# EAGLE design circuito_domotica_damiano (EAGLE 9.1.3)
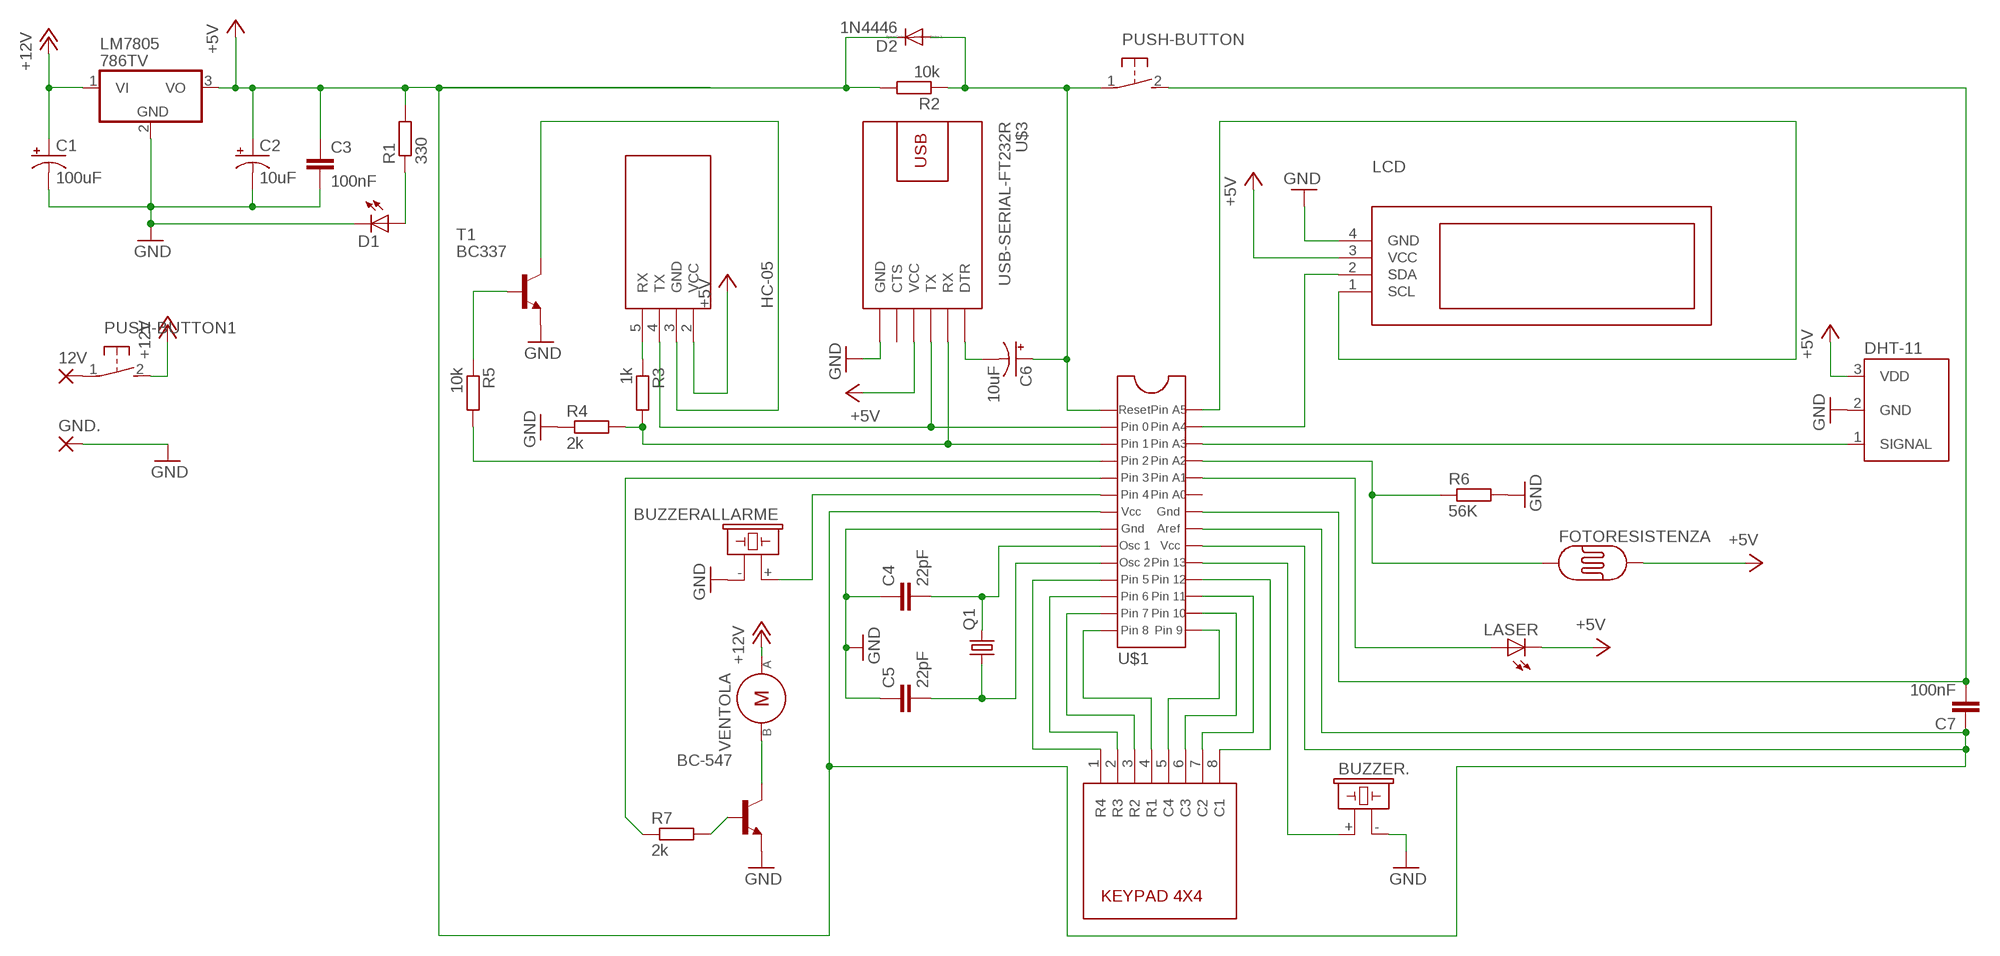
[diagram p0: schematic, sheet 1]

## Parts
12V  WIREPAD1,6/0,8  [1,6/0,8]
BC-547  BC547-NPN-TO92-CBE  [TO92-CBE]
BUZZER.  BPT-24X  [BPT-24X]
BUZZERALLARME  BPT-24X  [BPT-24X]
C1  100uF  CPOL-USE2,5-6E  [E2,5-6E]
C2  10uF  CPOL-USE2,5-6E  [E2,5-6E]
C3  100nF  C-EU025-030X050  [C025-030X050]
C4  22pF  C-EU025-030X050  [C025-030X050]
C5  22pF  C-EU025-030X050  [C025-030X050]
C6  10uF  CPOL-USE2,5-6E  [E2,5-6E]
C7  100nF  C-EU025-030X050  [C025-030X050]
D1  SFH482  [SFH482]
D2  1N4446  [DO35-10]
DHT-11  DS18B20  [TO-92-AMMO]
FOTORESISTENZA  PHOTOCELLPTH  [PHOTOCELL]
GND.  WIREPAD1,6/0,8  [1,6/0,8]
HC-05  WIRELESS-BLUETOOTH-HC-05  [WIRELESS-BLUETOOTH-HC-05]
LASER  SFH482  [SFH482]
LCD  DISPLAY-OLED-128X32  [DISPLAY-OLED-128X32]
LM7805  786TV  [TO220V]
PUSH-BUTTON  DTS-3  [DTS-3]
PUSH-BUTTON1  DTS-3  [DTS-3]
Q1  CRYSTALHC49S  [HC49/S]
R1  330  R-EU_0207/10  [0207/10]
R2  10k  R-EU_0207/10  [0207/10]
R3  1k  R-EU_0207/10  [0207/10]
R4  2k  R-EU_0207/10  [0207/10]
R5  10k  R-EU_0207/10  [0207/10]
R6  56K  R-EU_0207/10  [0207/10]
R7  2k  R-EU_0207/10  [0207/10]
T1  BC337  [TO92]
U$1  DEVU  [PACU]
U$2  KEYPAD4X4  [KEYPAD4X4]
U$3  USB-SERIAL-FT232R  [USB-SERIAL-FT232R]
VENTOLA  DEVU4  [PACU4]

## Nets
+5V: C2.+ C3.1 C7.1 D2.C DHT-11.3(VDD) FOTORESISTENZA.2 HC-05.2(VCC) LASER.K(C) LCD.3(VCC) LM7805.3(VO) R1.2 R2.2 U$1.7(VCC) U$1.20(VCC1) U$1.21(AREF) U$3.4(VCC)
+12V: C1.+ LM7805.1(VI) PUSH-BUTTON1.2 VENTOLA.P$1
GND: BC-547.E BUZZER..- BUZZERALLARME.- C1.- C2.- C3.2 C4.1 C5.1 D1.K(C) DHT-11.2(GND) GND..1(P) LCD.4(GND) LM7805.2(GND) R4.1 R6.2 T1.1(E) U$1.8(GND) U$3.6(GND)
N$1: LCD.2(SDA) U$1.27(PINA4)
N$2: DHT-11.1(SIGNAL) U$1.26(PINA3)
N$3: C6.+ D2.A PUSH-BUTTON.1 R2.1 U$1.1(RESET)
N$5: HC-05.3(GND) T1.3(C)
N$6: FOTORESISTENZA.1 R6.1 U$1.25(PINA2)
N$7: C4.2 Q1.2 U$1.9(X1)
N$8: C5.2 Q1.1 U$1.10(X2)
N$9: LASER.A U$1.24(PINA1)
N$10: C7.2 PUSH-BUTTON.2 U$1.22(GND1)
N$11: 12V.1(P) PUSH-BUTTON1.1
N$12: R5.1 T1.2(B)
N$13: BUZZERALLARME.+ U$1.6(PIN4)
N$14: R5.2 U$1.4(PIN2)
N$15: LCD.1(SCL) U$1.28(PINA5)
N$16: C6.- U$3.1(DTR)
N$17: BUZZER..+ U$1.19(PIN13)
N$18: U$1.18(PIN12) U$2.8(C1)
N$19: U$1.17(PIN11) U$2.7(C2)
N$20: U$1.16(PIN10) U$2.6(C3)
N$21: U$1.15(PIN9) U$2.5(C4)
N$22: BC-547.C VENTOLA.P$2
N$23: U$1.14(PIN8) U$2.4(R1)
N$24: U$1.13(PIN7) U$2.3(R2)
N$25: U$1.12(PIN6) U$2.2(R3)
N$26: BC-547.B R7.2
N$27: D1.A R1.1
N$28: U$1.11(PIN5) U$2.1(R4)
N$29: R7.1 U$1.5(PIN3)
N$31: HC-05.4(TX) U$1.2(PIN0) U$3.3(TX)
N$32: HC-05.5(RX) R3.1
N$33: R3.2 R4.2 U$1.3(PIN1) U$3.2(RX)
Unconnected: U$1.23(PINA0) U$3.5(CTS)

## Library data of the parts
12V GND. = wirepad:WIREPAD: Wire PAD connect wire on PCB
BC-547 = transistor:*-NPN-: NPN Transistror BF959 corrected 2008.03.06
BUZZER. BUZZERALLARME = buzzer:BPT-24X; OC_FARNELL: unknown; OC_NEWARK: unknown
C1 C2 C6 = rcl:CPOL-US: POLARIZED CAPACITOR, American symbol; SPICEPREFIX: C
C3-C5 C7 = rcl:C-EU: CAPACITOR, European symbol; SPICEPREFIX: C
D1 LASER = led:SFH482: IR LED infrared emitting diode, Infineon
D2 = diode:1N4446: DIODE high speed (Philips)
DHT-11 = SparkFun-Sensors:DS18B20: Dallas/Maxim DS18B20 1-wire temperature sensor Datasheet: http://datasheets.maximintegrated.com/en/ds/DS18B20.pdf temp thermometer 1-wire one-wire one wire; STORE_ID: SEN-00245
FOTORESISTENZA = SparkFun-Sensors:PHOTOCELL: CdS photoresistor. This is a low cost way to detect light levels. Resistance decreases with more incoming light. SparkFun SKU: SEN-09088
HC-05 = diy-modules (1):WIRELESS-BLUETOOTH-HC-05: Bluetooth Transceiver Module based on HC-05 board Tutorial is available here: https://arduino-info.wikispaces.com/BlueTooth-HC05-HC06-Modules-How-To Click here to find device on ebay.com <http://www.ebay.com/sch/hc-05+module+rs232>
LCD = diy-modules:DISPLAY-OLED-128X32: 128x32 Dot Matrix OLED Module with I2C interface based on SSD1306 chip More details available here: http://www.tinyosshop.com/index.php?route=product/product&product_id=953 Schematic available here: http://www.tinyosshop.com/datasheet/OLED%2012832.pdf SSD1306 datasheet: https://cdn-shop.adafruit.com/datasheets/SSD1306.pdf Click here to find device on ebay.com <http://www.ebay.com/sch/oled+display+128x32+i2c>
LM7805 = linear:78*: Positive VOLTAGE REGULATOR Source: http://cache.national.com/ds/LM/LM78L05.pdf http://www.fairchildsemi.com/ds/LM/LM7805.pdf
PUSH-BUTTON PUSH-BUTTON1 = switch-tact:DTS-3
Q1 = crystal:CRYSTAL: CRYSTAL; OC_FARNELL: 1667008; OC_NEWARK: unknown
R1-R7 = resistor:R-EU_: RESISTOR, European symbol
T1 = transistor:BC337: NPN TRANSISTOR
U$1 = perArduino 20.49.00:DEVU
U$2 = keypad_4x4_raw (1):KEYPAD4X4
U$3 = diy-modules:USB-SERIAL-FT232R: USB to Serial UART Converter based on FT232R chip More information about FT232R chip is available here: http://www.ftdichip.com/Products/ICs/FT232R.htm Click here to find device on ebay.com <http://www.ebay.com/sch/ft232rl+arduino+download+max232>
VENTOLA = perArduino 20.49.00:DEVU4

## Board
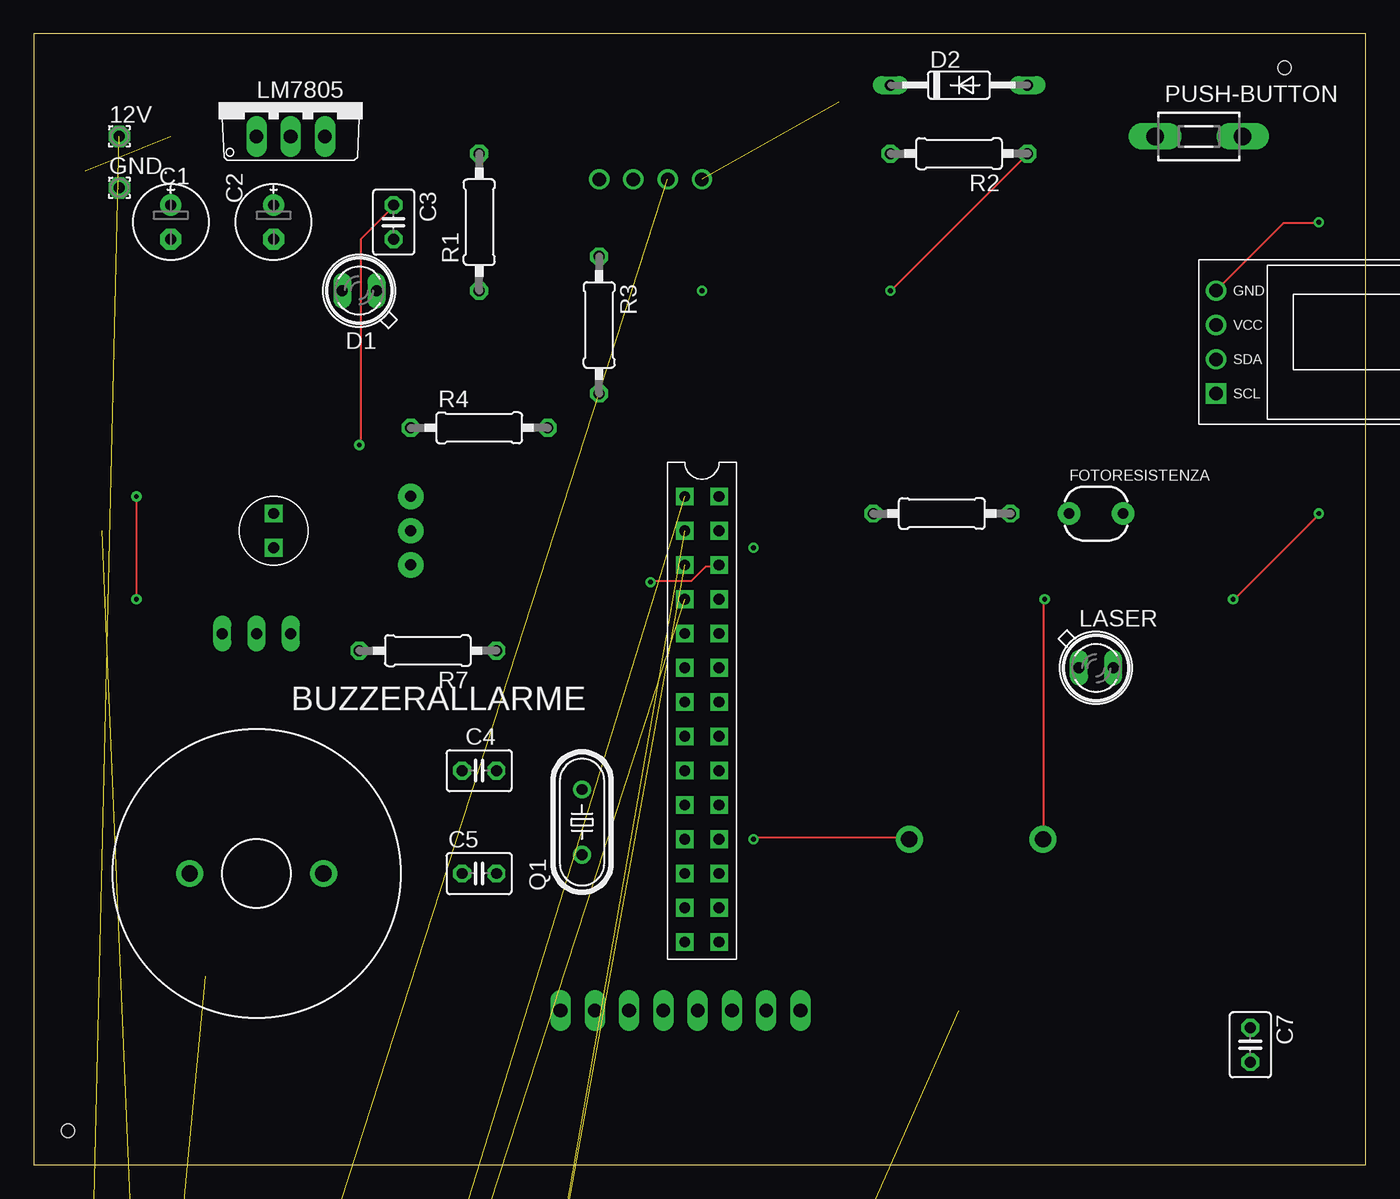
[diagram p1: board, top side]
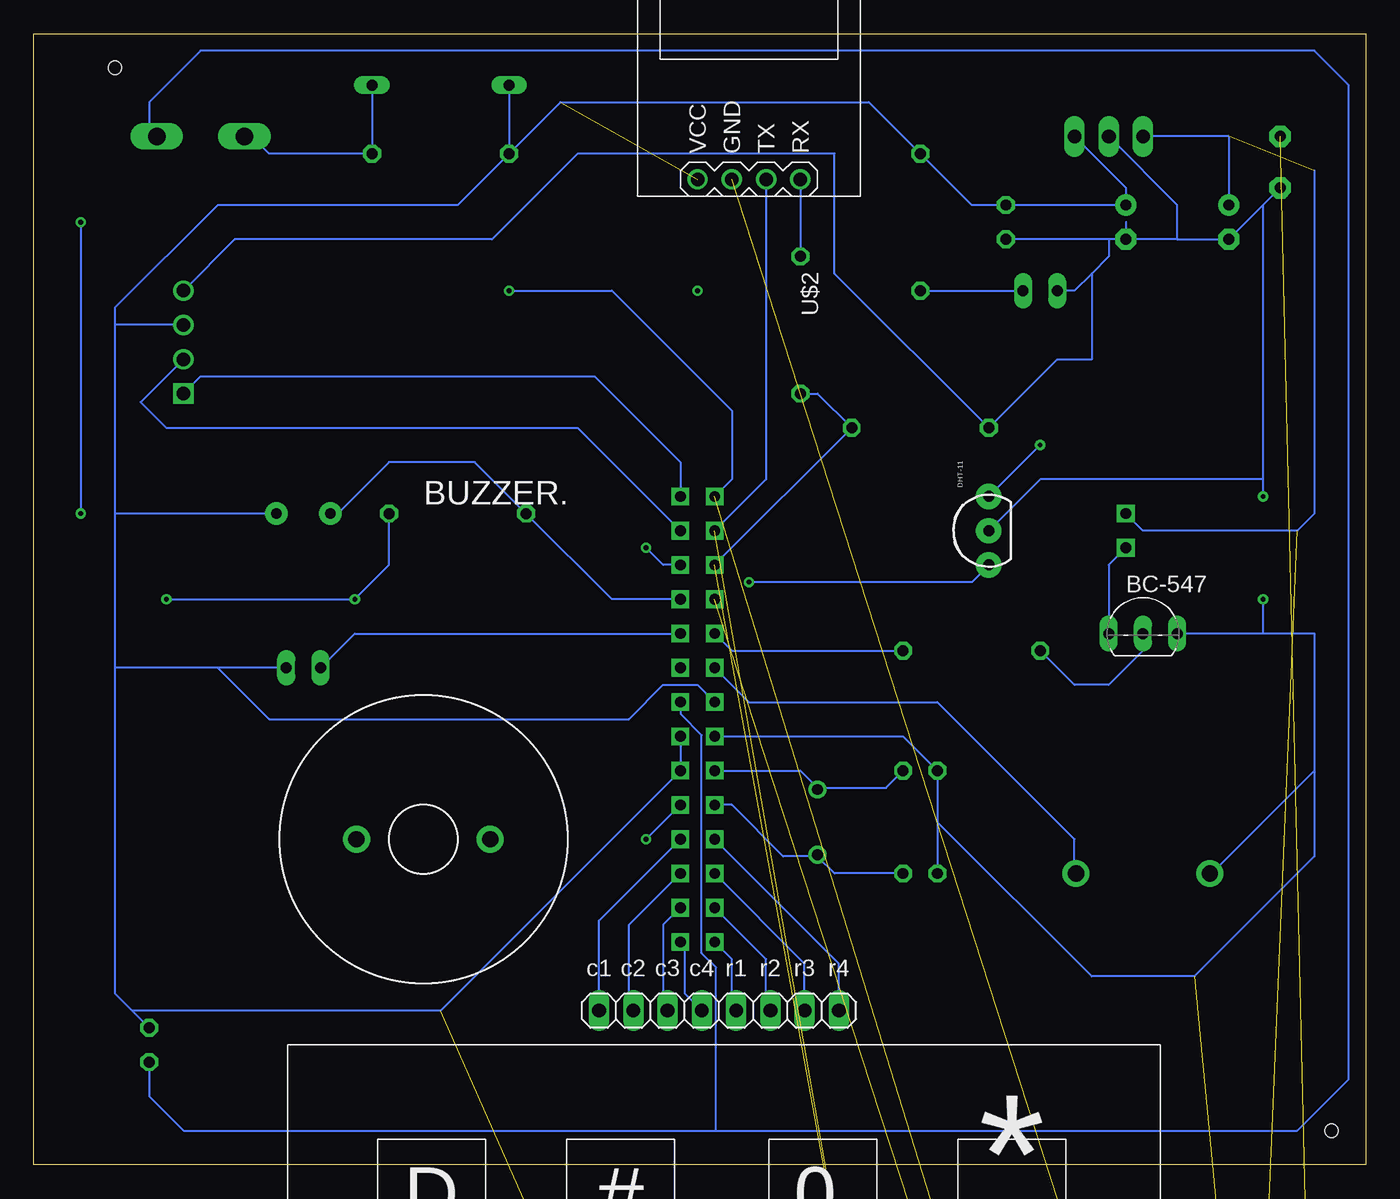
[diagram p2: board, bottom side, seen from below]

Size 98.73 x 83.81 mm. Coordinates in mm from the lower left corner, seen from the top.
Outline: 0,0 98.73,0 98.73,83.81 0,83.81 0,0
Copper layers (1*16): Top 0.035mm / dielectric 1.5mm / Bottom 0.035mm
Design rules "default": minimum track width 6mil, minimum drill 0.35mm, track to track 6mil, track to pad 6mil, pad to pad 6mil, via to via 6mil, smd to smd 6mil, copper to edge 40mil, drill to drill 6mil, minimum pad ring 10mil, minimum via ring 8mil, stop-mask expansion 4mil, vias tented up to drill 0mil, thermal gap 10mil
Holes 1 mm at 92.71,81.28 2.54,2.54

### Footprints (pad centres in the part's own frame; a part is rotated, then mirrored left to right if it is on the bottom)
1,6/0,8 = drill 0.813 pad 1.6 octagon: 1 0,0
TO92-CBE = drill 0.813 long: B 0,0; C -2.54,0; E 2.54,0
BPT-24X = drill 1.2 pad 2: + 4.96,0; - -4.96,0
E2,5-6E = drill 0.813 pad 1.575: + -1.27,0 | drill 0.813 pad 1.575 octagon: - 1.27,0
C025-030X050 = drill 0.813 octagon: 1 -1.27,0; 2 1.27,0
SFH482 = drill 0.813 long: A -1.27,0; K 1.27,0
DO35-10 = drill 0.813 long: A 5.08,0; C -5.08,0
TO-92-AMMO = drill 0.813 pad 1.88: 1 -2.54,0; 2 0,0; 3 2.54,0
PHOTOCELL = drill 0.8 pad 1.676: 1 -2,0; 2 2,0
WIRELESS-BLUETOOTH-HC-05 = drill 1: 2 -3.81,-17.145; 3 -1.27,-17.145; 4 1.27,-17.145; 5 3.81,-17.145
DISPLAY-OLED-128X32 = drill 1 square: 1 -17.78,-3.81 | drill 1: 2 -17.78,-1.27; 3 -17.78,1.27; 4 -17.78,3.81
TO220V = drill 1.016 long: 1 -2.54,-2.54; 2 0,-2.54; 3 2.54,-2.54
DTS-3 = drill 1.3 long: 1 -3.25,0; 2 3.25,0
HC49/S = drill 0.813: 1 -2.413,0; 2 2.413,0
0207/10 = drill 0.813 octagon: 1 -5.08,0; 2 5.08,0
TO92 = drill 0.813 octagon: 1 1.27,0; 2 0,1.905; 3 -1.27,0
PACU = drill 0.8 square: 1 -1.27,5.08; 2 -1.27,2.54; 3 -1.27,0; 4 -1.27,-2.54; 5 -1.27,-5.08; 6 -1.27,-7.62; 7 -1.27,-10.16; 8 -1.27,-12.7; 9 -1.27,-15.24; 10 -1.27,-17.78; 11 -1.27,-20.32; 12 -1.27,-22.86; 13 -1.27,-25.4; 14 -1.27,-27.94; 15 1.27,-27.94; 16 1.27,-25.4; 17 1.27,-22.86; 18 1.27,-20.32; 19 1.27,-17.78; 20 1.27,-15.24; 21 1.27,-12.7; 22 1.27,-10.16; 23 1.27,-7.62; 24 1.27,-5.08; 25 1.27,-2.54; 26 1.27,0; 27 1.27,2.54; 28 1.27,5.08
KEYPAD4X4 = drill 1.016 long: 1 23.81,-2.54; 2 26.35,-2.54; 3 28.89,-2.54; 4 31.43,-2.54; 5 33.97,-2.54; 6 36.51,-2.54; 7 39.05,-2.54; 8 41.59,-2.54
USB-SERIAL-FT232R = drill 1 square: 1 11.43,6.35 | drill 1: 2 11.43,3.81; 3 11.43,1.27; 4 11.43,-1.27; 5 11.43,-3.81; 6 11.43,-6.35
PACU4 = drill 0.8 square: P$1 -1.27,0; P$2 1.27,0

### Placement (x,y rotation side)
12V  6.35,76.2 0 top
BC-547  16.51,39.37 0 bottom
BUZZER.  69.85,24.13 0 bottom
BUZZERALLARME  16.51,21.59 0 top
C1  10.16,69.85 270 top
C2  17.78,69.85 270 top
C3  26.67,69.85 270 top
C4  33.02,29.21 0 top
C5  33.02,21.59 0 top
C6  3.81,-99.06 0 top  (outside the outline)
C7  90.17,8.89 270 top
D1  24.13,64.77 180 top
D2  68.58,80.01 0 top
DHT-11  27.94,46.99 90 bottom
FOTORESISTENZA  78.74,48.26 0 top
GND.  6.35,72.39 0 top
HC-05  45.72,90.17 0 bottom
LASER  78.74,36.83 0 top
LCD  105.41,60.96 0 top
LM7805  19.05,78.74 0 top
PUSH-BUTTON  86.36,76.2 0 top
PUSH-BUTTON1  6.35,-60.96 0 top  (outside the outline)
Q1  40.64,25.4 90 top
R1  33.02,69.85 90 top
R2  68.58,74.93 180 top
R3  41.91,62.23 270 top
R4  33.02,54.61 0 top
R5  6.35,-72.39 0 top  (outside the outline)
R6  67.31,48.26 0 top
R7  29.21,38.1 180 top
T1  3.81,-66.04 0 top  (outside the outline)
U$1  49.53,44.45 0 top
U$2  15.24,8.89 180 bottom
U$3  13.97,-85.09 0 top  (outside the outline)
VENTOLA  17.78,46.99 270 top

### Tracks (layer width: path | path; a pad name or v marks a point on that pad's centre or on a via)
+5V  (via drill 0.35)  (2 unrouted)
  Top 0.152: 50.9,29.26 U$1.20 | 26.77,71.02 C3.1 26.67,71.02 24.23,68.58 24.23,53.34 v24.13,53.34
  Bottom 0.152: LM7805.3 17.78,72.39 C2.+ C3.1 29.21,71.12 R1.2 36.83,78.74 59.69,78.74 R2.2 | D2.C R2.2 | R2.2 67.31,71.12 85.09,71.12 92.71,63.5 92.71,62.23 | 92.71,62.23 92.71,48.26 | 92.71,48.26 92.71,36.83 | 81.28,48.26 81.33,48.26 | 81.33,48.26 92.71,48.26 | LCD.3 92.71,62.23 | 92.71,36.83 92.71,12.7 91.44,11.43 | 91.44,11.43 C7.1 | LASER.K 85.09,36.83 | 85.09,36.83 92.71,36.83 | FOTORESISTENZA.2 80.87,48.21 81.33,48.21 81.33,48.26 | 91.44,11.43 68.58,11.43 U$1.20 U$1.21 | 85.09,36.83 81.28,33.02 54.61,33.02 52.07,35.56 49.53,35.56 U$1.7 | v24.13,53.34 DHT-11.3
+12V  (2 unrouted)
  Top 0.152: VENTOLA.P$1 17.68,48.26
  Bottom 0.152: LM7805.1 10.16,76.2 C1.+ | VENTOLA.P$1 16.51,46.99 5.08,46.99 3.81,48.26 3.81,73.66
GND  (via drill 0.35)  (2 unrouted)
  Top 0.152: 6.35,72.34 GND..1 | 72.49,48.36 R6.2 | BUZZER..- 74.83,24.23 74.83,41.91 v74.93,41.91 | v95.25,48.26 95.25,48.16 89,41.91 v88.9,41.91 | LCD.4 92.66,69.8 95.25,69.8 v95.25,69.85 | v7.62,41.91 v7.62,49.53
  Bottom 0.152: 31.75,25.4 C4.1 34.29,31.75 U$1.8 | 31.75,25.4 31.75,21.79 | 31.75,21.79 31.71,21.75 | 31.75,21.79 C5.1 | 7.62,71.12 C1.- 13.97,68.58 | GND..1 7.62,71.12 | 17.78,69.85 C2.- | 13.97,68.58 C2.- | C2.- 19.05,68.58 | 19.05,68.58 C3.2 | 19.05,68.58 19.05,67.31 20.32,66.04 | 20.32,66.04 21.59,64.77 D1.K | 13.97,68.58 13.97,71.12 LM7805.2 | 20.32,66.04 20.32,59.69 22.86,59.69 R4.1 39.37,66.04 39.37,74.93 46.99,74.93 58.42,74.93 64.77,68.58 83.82,68.58 LCD.4 | 7.62,71.12 7.62,50.8 | 3.81,29.21 3.81,39.37 7.62,39.37 | 3.81,29.21 11.4,21.61 | 11.4,21.61 11.43,21.59 | 7.62,39.37 BC-547.E | 3.81,29.21 3.81,22.86 12.7,13.97 20.32,13.97 31.75,25.4 | 7.62,50.8 24.13,50.8 DHT-11.2 | 11.4,21.61 11.43,21.64 BUZZERALLARME.- | 7.62,50.8 v7.62,49.53 | v7.62,41.91 7.62,39.37 | v95.25,69.85 v95.25,48.26 | v88.9,41.91 v74.93,41.91 72.39,44.45 R6.2
N$1
  Bottom 0.152: LCD.2 90.81,56.52 88.9,54.61 58.42,54.61 U$1.27
N$2  (via drill 0.35)
  Top 0.152: U$1.26 50.75,44.35 49.84,44.35 48.77,43.28 45.72,43.28 v45.72,43.18
  Bottom 0.152: DHT-11.1 29.21,43.18 v45.72,43.18 | v53.34,45.72 52.07,44.45 U$1.26
N$3  (via drill 0.35)  (1 unrouted)
  Top 0.152: R2.1 73.61,74.83 63.55,64.77 v63.5,64.77
  Bottom 0.152: D2.A R2.1 81.28,74.93 82.55,76.2 PUSH-BUTTON.1 | v63.5,64.77 55.88,64.77 46.99,55.88 46.99,50.8 U$1.1
N$4  (via drill 0.35)
  other vias: 49.53,64.77
N$5  (1 unrouted)
N$6
  Bottom 0.152: FOTORESISTENZA.1 76.61,48.21 76.15,48.21 76.2,48.26 72.39,52.07 66.04,52.07 R6.1 55.88,41.91 U$1.25
N$7
  Top 0.152: 40.74,27.84 Q1.2 40.74,27.74
  Bottom 0.152: C4.2 35.56,27.94 40.59,27.94 40.59,27.84 Q1.2 40.69,27.89 40.64,27.94 41.91,29.21 U$1.9
N$8
  Top 0.152: 40.74,22.86 Q1.1
  Bottom 0.152: C5.2 39.37,21.59 40.59,22.81 40.59,22.96 Q1.1 40.69,22.86 | U$1.10 46.99,26.67 43.18,22.86 40.69,22.86 | 40.64,22.86 40.69,22.86
N$9
  Bottom 0.152: LASER.A 74.93,39.37 U$1.24
N$10
  Bottom 0.152: 48.16,2.54 87.63,2.54 90.17,5.08 C7.2 | 48.16,2.54 5.08,2.54 1.27,6.35 1.27,80.01 3.81,82.55 86.36,82.55 90.17,78.74 90.17,76.2 | 48.16,2.54 48.16,14.63 49.23,15.7 49.23,31.85 50.75,33.38 50.75,34.29 U$1.22 | 90.17,76.2 PUSH-BUTTON.2 | 90.22,76.2 90.17,76.2
N$11  (1 unrouted)
N$12  (1 unrouted)
N$13
  Bottom 0.152: U$1.6 45.72,34.29 31.75,34.29 21.59,24.13 21.59,21.64 | 21.59,21.59 21.59,21.64 | 21.59,21.64 21.49,21.64 BUZZERALLARME.+ | 21.64,21.64 21.59,21.64
N$14  (1 unrouted)
N$15
  Bottom 0.152: LCD.1 86.36,58.42 57.15,58.42 50.8,52.07 U$1.28
N$16  (1 unrouted)
N$17  (via drill 0.35)
  Top 0.152: 50.9,26.67 U$1.19 | v53.34,24.13 53.34,24.23 64.77,24.23 BUZZER..+
  Bottom 0.152: v53.34,24.13 U$1.19
N$18
  Bottom 0.152: U$2.8 56.83,18.1 U$1.18
N$19
  Bottom 0.152: U$2.7 54.61,11.75 54.61,17.78 U$1.17
N$20
  Bottom 0.152: U$2.6 52.07,11.75 52.07,17.78 U$1.16
N$21
  Bottom 0.152: U$2.5 50.48,12.7 50.48,16.51 U$1.15
N$22
  Bottom 0.152: VENTOLA.P$2 19.05,44.45 BC-547.C
N$23
  Bottom 0.152: U$1.14 46.99,15.24 46.99,11.43 U$2.4
N$24
  Bottom 0.152: 44.45,11.43 44.45,15.24 U$1.13 | 44.45,11.43 U$2.3 | 44.5,11.43 44.45,11.43
N$25
  Bottom 0.152: U$2.2 41.59,14.92 U$1.12
N$26
  Bottom 0.152: BC-547.B 16.51,38.1 19.05,35.56 21.59,35.56 R7.2
N$27
  Bottom 0.152: R1.1 D1.A
N$28
  Bottom 0.152: U$2.1 39.05,14.92 U$1.11
N$29
  Bottom 0.152: U$1.5 46.99,38.1 R7.1
N$31  (1 unrouted)
  Bottom 0.152: U$1.2 44.45,50.8 44.45,72.39 44.5,72.39 44.5,73 HC-05.4
N$32
  Bottom 0.152: HC-05.5 R3.1
N$33  (1 unrouted)
  Bottom 0.152: R3.2 40.64,57.15 R4.2 U$1.3